# Altium schematic sheet Micro_Conection.SchDoc (part 1 of 3)
size A
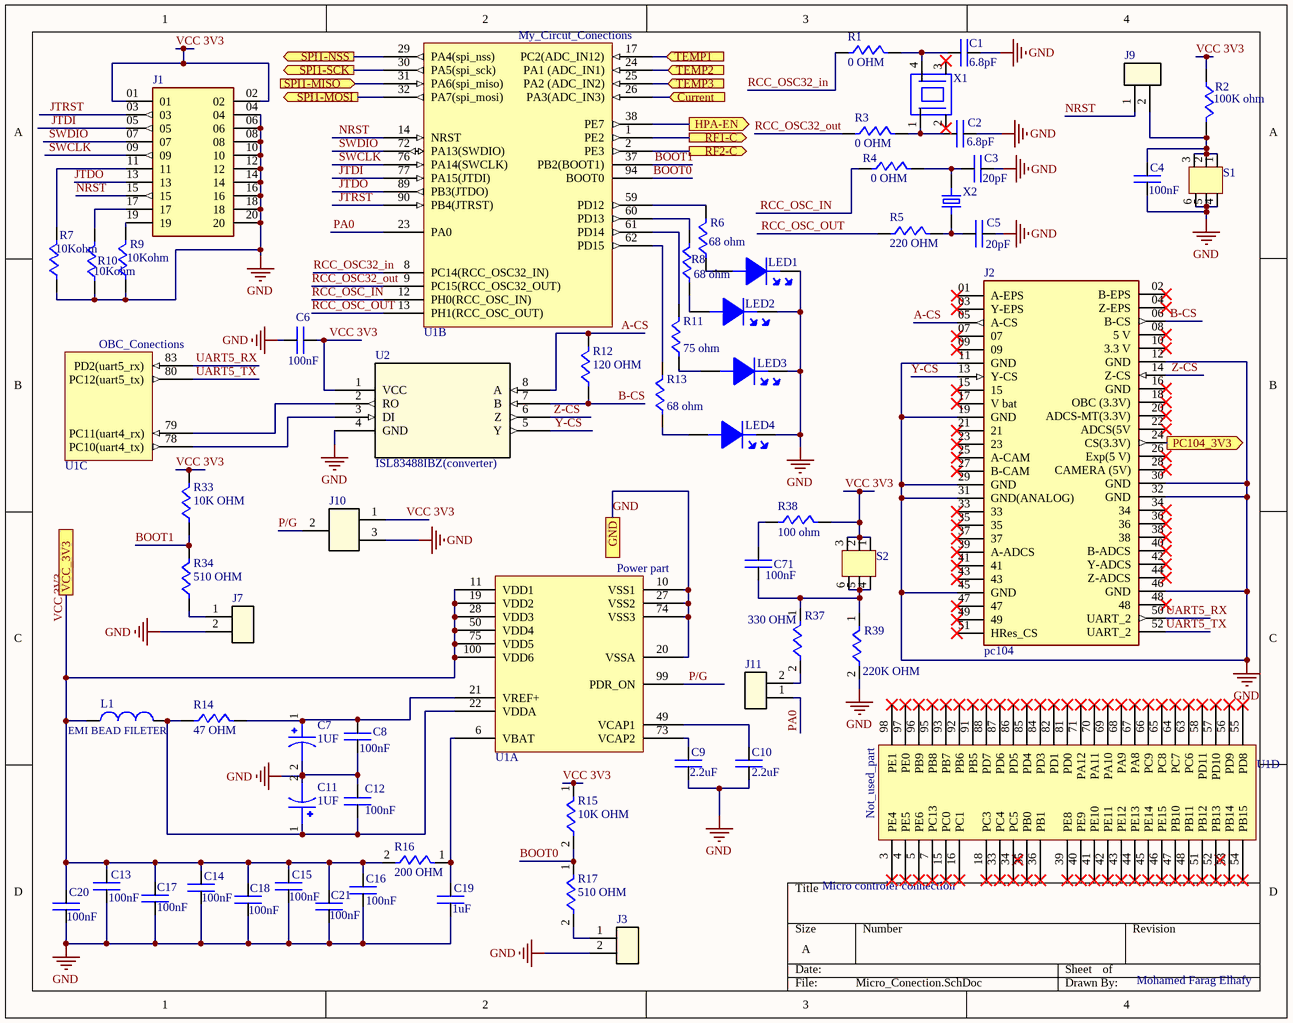
[diagram p0: Micro_Conection.SchDoc]

## Parts
C1  Capacitance: 6.8pF  [0805 C]  (hidden comment: CAP CER 6.8PF 100V NPO 0805)
C2  Capacitance: 6.8pF  [0805 C]  (hidden comment: CAP CER 6.8PF 100V NPO 0805)
C3  Capacitance: 20pF  [0805 C]  (hidden comment: CAP CER 20PF 25V NP0 0603)
C4  Capacitance: 100nF  [0805 C]  (hidden comment: CAP CER 0.1UF 10V 0805)
C5  Capacitance: 20pF  [0805 C]  (hidden comment: CAP CER 20PF 25V NP0 0603)
C6  Capacitance: 100nF  [0805 C]  (hidden comment: CAP CER 0.1UF 10V 0805)
C7  1UF  [1206 C]
C8  Capacitance: 100nF  [0805 C]  (hidden comment: CAP CER 0.1UF 10V 0805)
C9  Capacitance: 2.2uF  [0805 C]  (hidden comment: CAP CER 2.2UF 25V X7R 0805)
C10  Capacitance: 2.2uF  [0805 C]  (hidden comment: CAP CER 2.2UF 25V X7R 0805)
C11  1UF  [1206 C]
C12  Capacitance: 100nF  [0805 C]  (hidden comment: CAP CER 0.1UF 10V 0805)
C13  Capacitance: 100nF  [0805 C]  (hidden comment: CAP CER 0.1UF 10V 0805)
C14  Capacitance: 100nF  [0805 C]  (hidden comment: CAP CER 0.1UF 10V 0805)
C15  Capacitance: 100nF  [0805 C]  (hidden comment: CAP CER 0.1UF 10V 0805)
C16  Capacitance: 100nF  [0805 C]  (hidden comment: CAP CER 0.1UF 10V 0805)
C17  Capacitance: 100nF  [0805 C]  (hidden comment: CAP CER 0.1UF 10V 0805)
C18  Capacitance: 100nF  [0805 C]  (hidden comment: CAP CER 0.1UF 10V 0805)
C19  Capacitance: 1uF  [0805 C]  (hidden comment: CAP CER 1UF 16V X7R 0805)
C20  Capacitance: 100nF  [0805 C]  (hidden comment: CAP CER 0.1UF 10V 0805)
C21  Capacitance: 100nF  [0805 C]  (hidden comment: CAP CER 0.1UF 10V 0805)
C71  Capacitance: 100nF  [0805 C]  (hidden comment: CAP CER 0.1UF 10V 0805)
J1  CONN HEADER VERT 20POS 2.54MM  [JTAG]  (value not drawn)
J2  pc104  [pc104]
J3  CONN HEADER VERT 2POS 2.54MM  [jumber 2]  (value not drawn)
J7  CONN HEADER VERT 2POS 2.54MM  [jumber 2]  (value not drawn)
J9  CONN HEADER VERT 2POS 2.54MM  [jumber 2]  (value not drawn)
J10  CONN HEADER VERT 3POS 2.54MM  [jumber]  (value not drawn)
J11  CONN HEADER VERT 2POS 2.54MM  [jumber 2]  (value not drawn)
L1  EMI BEAD FILETER  [0805 C]
LED1  LED GREEN CLEAR CHIP SMD R/A  [LED]  (value not drawn)
LED2  LED ORANGE CLEAR SMD  [LED]  (value not drawn)
LED3  LED RED CLEAR SMD  [LED]  (value not drawn)
LED4  LED YELLOW CLEAR SMD  [LED]  (value not drawn)
R1  0 OHM  [0805 R]
R2  100K ohm  [0805 R]
R3  0 OHM  [0805 R]
R4  0 OHM  [0805 R]
R5  220 OHM  [0805 R]
R6  Resistance: 68 ohm  [0805 R]  (hidden comment: RES 68 OHM 5% 1/4W 0805)
R7  10Kohm  [0805 R]
R8  Resistance: 68 ohm  [0805 R]  (hidden comment: RES 68 OHM 5% 1/4W 0805)
R9  10Kohm  [0805 R]
R10  10Kohm  [0805 R]
R11  Resistance: 75 ohm  [0805 R]  (hidden comment: RES 75 OHM 1% 1/4W 0805)
R12  120 OHM  [0805 R]
R13  Resistance: 68 ohm  [0805 R]  (hidden comment: RES 68 OHM 5% 1/4W 0805)
R14  47 OHM  [0805 R]
R15  10K OHM  [0805 R]
R16  200 OHM  [0805 R]
R17  510 OHM  [0805 R]
R33  10K OHM  [0805 R]
R34  510 OHM  [0805 R]
R37  330 OHM  [0805 R]
R38  Resistance: 100 ohm  [0805 R]  (hidden comment: RES SMD 100 OHM 5% 1/2W 0805)
R39  220K OHM  [0805 R]
S1  Pushbutton Switches 2 Poles Vertical  [push button]  (value not drawn)
S2  Pushbutton Switches 2 Poles Vertical  [push button]  (value not drawn)
U1  STM32F407VGT6_1  [STM32F407VGT6 P]  (value not drawn)  (parts A,B,C,D of 4)
U2  ISL83488IBZ(converter)  [ISL83488IBZ]
X1  MC-146 32.7680KA-E3: ROHS  [CRYSTAL 32K]  (value not drawn)
X2  CRYSTAL 8.0000MHZ 32PF SMD  [XTAL_ECS-80-32-5PX-TR]  (value not drawn)

## Ports
Current (in), GND, HPA-EN (out), PC104_3V3 (out), RF1-C (out), RF2-C (out), SPI1-MISO (in), SPI1-MOSI (out), SPI1-NSS (out), SPI1-SCK (out), TEMP1 (in), TEMP2 (in), TEMP3 (in), VCC_3V3

## Nets
GND: C1.1 C2.1 C3.1 C4.2 C5.1 C6.1 C7.2 C8.2 C9.2 C10.2 C11.2 C12.1 C13.2 C14.2 C15.2 C16.2 C17.2 C18.2 C19.2 C20.2 C21.2 J1.04 J1.06 J1.08 J1.10 J1.12 J1.14 J1.16 J1.18 J1.20 J2.11(GND) J2.12(GND) J2.19(GND) J2.29(GND) J2.30(GND) J2.31(GND(ANALOG)) J2.32(GND) J2.45(GND) J2.46(GND) J3.2 J7.2 J10.3 LED1.2 LED2.2 LED3.2 LED4.2 R7.2 R9.2 R10.2 R39.2 S1.4 S1.5 S1.6 U1.10(VSS1) U1.20(VSSA) U1.27(VSS2) U1.74(VSS3) U2.4(GND) ; port GND
A-CS: J2.05(A-CS) R12.1 U2.8(A)
B-CS: J2.06(B-CS) R12.2 U2.7(B)
BOOT0: R15.2 R17.1 U1.94(BOOT0)
BOOT1: R33.2 R34.1 U1.37(PB2(BOOT1))
Current: U1.26(PA3(ADC_IN3)) ; port Current
HPA-EN: U1.38(PE7) ; port HPA-EN
JTDI: J1.05 U1.77(PA15(JTDI))
JTDO: J1.13 U1.89(PB3(JTDO))
JTRST: J1.03 U1.90(PB4(JTRST))
NRST: J1.15 J9.1 U1.14(NRST)
P/G: J10.2 U1.99(PDR_ON)
PA0: J11.1 U1.23(PA0)
PC104_3V3: J2.24(CS(3.3V)) ; port PC104_3V3
RCC_OSC32_in: R1.2 U1.8(PC14(RCC_OSC32_IN))
RCC_OSC32_out: R3.2 U1.9(PC15(RCC_OSC32_OUT))
RCC_OSC_IN: R4.2 U1.12(PH0(RCC_OSC_IN))
RCC_OSC_OUT: R5.2 U1.13(PH1(RCC_OSC_OUT))
RF1-C: U1.1(PE2) ; port RF1-C
RF2-C: U1.2(PE3) ; port RF2-C
SPI1-MISO: U1.31(PA6(spi_miso)) ; port SPI1-MISO
SPI1-MOSI: U1.32(PA7(spi_mosi)) ; port SPI1-MOSI
SPI1-NSS: U1.29(PA4(spi_nss)) ; port SPI1-NSS
SPI1-SCK: U1.30(PA5(spi_sck)) ; port SPI1-SCK
SWCLK: J1.09 U1.76(PA14(SWCLK))
SWDIO: J1.07 U1.72(PA13(SWDIO))
TEMP1: U1.17(PC2(ADC_IN12)) ; port TEMP1
TEMP2: U1.24(PA1_(ADC_IN1)) ; port TEMP2
TEMP3: U1.25(PA2_(ADC_IN2)) ; port TEMP3
UART5_RX: J2.50(UART_2) U1.83(PD2(uart5_rx))
UART5_TX: J2.52(UART_2) U1.80(PC12(uart5_tx))
VCC 3V3: C6.2 C13.1 C14.1 C15.1 C16.1 C17.1 C18.1 C20.1 C21.1 J1.01 J1.02 J10.1 L1.2 R2.2 R15.1 R16.2 R33.1 R38.1 S2.1 S2.2 S2.3 U1.11(VDD1) U1.19(VDD2) U1.28(VDD3) U1.50(VDD4) U1.75(VDD5) U1.100(VDD6) U2.1(VCC) ; port VCC_3V3
Y-CS: J2.13(Y-CS) U2.5(Y)
Z-CS: J2.14(Z-CS) U2.6(Z)
NetC1_2: C1.2 R1.1 X1.4
NetC2_2: C2.2 R3.1 X1.1
NetC3_2: C3.2 R4.1 X2.2
NetC4_1: C4.1 J9.2 R2.1 S1.1 S1.2 S1.3
NetC5_2: C5.2 R5.1 X2.1
NetC7_1: C7.1 C8.1 R14.1 U1.21(VREF+)
NetC9_1: C9.1 U1.73(VCAP2)
NetC10_1: C10.1 U1.49(VCAP1)
NetC11_1: C11.1 C12.2 L1.1 R14.2 U1.22(VDDA)
NetC19_1: C19.1 R16.1 U1.6(VBAT)
NetC71_1: C71.1 R38.2
NetC71_2: C71.2 R37.1 R39.1 S2.4 S2.5 S2.6
NetJ1_11: J1.11 R7.1
NetJ1_17: J1.17 R10.1
NetJ1_19: J1.19 R9.1
NetJ3_1: J3.1 R17.2
NetJ7_1: J7.1 R34.2
NetJ11_2: J11.2 R37.2
NetLED1_1: LED1.1 R6.2
NetLED2_1: LED2.1 R8.2
NetLED3_1: LED3.1 R11.2
NetLED4_1: LED4.1 R13.2
NetR6_1: R6.1 U1.59(PD12)
NetR8_1: R8.1 U1.60(PD13)
NetR11_1: R11.1 U1.61(PD14)
NetR13_1: R13.1 U1.62(PD15)
NetU1_78: U1.78(PC10(uart4_tx)) U2.3(DI)
NetU1_79: U1.79(PC11(uart4_rx)) U2.2(RO)

Not connected (* = marked no-connect by the designer): J2 01(A-EPS)* 02(B-EPS)* 03(Y-EPS)* 04(Z-EPS)* 07* 08(5_V)* 09* 10(3.3_V)* 15* 16(GND)* 17(V_bat)* 18(OBC_(3.3V))* 20(ADCS-MT(3.3V))* 21* 22(ADCS(5V)* 23* 25(A-CAM)* 26(Exp(5_V))* 27(B-CAM)* 28(CAMERA_(5V))* 33* 34* 35* 36* 37* 38* 39(A-ADCS)* 40(B-ADCS)* 41* 42(Y-ADCS)* 43* 44(Z-ADCS)* 47* 48* 49* 51(HRes_CS)*; U1 3(PE4)* 4(PE5)* 5(PE6)* 7(PC13)* 15(PC0)* 16(PC1)* 18(PC3)* 33(PC4)* 34(PC5)* 35(PB0)* 36(PB1)* 39(PE8)* 40(PE9)* 41(PE10)* 42(PE11)* 43(PE12)* 44(PE13)* 45(PE14)* 46(PE15)* 47(PB10)* 48(PB11)* 51(PB12)* 52(PB13)* 53(PB14)* 54(PB15)* 55(PD8)* 56(PD9)* 57(PD10)* 58(PD11)* 63(PC6)* 64(PC7)* 65(PC8)* 66(PC9)* 67(PA8)* 68(PA9)* 69(PA10)* 70(PA11)* 71(PA12)* 81(PD0)* 82(PD1)* 84(PD3)* 85(PD4)* 86(PD5)* 87(PD6)* 88(PD7)* 91(PB5)* 92(PB6)* 93(PB7)* 95(PB8)* 96(PB9)* 97(PE0)* 98(PE1)*; X1 2(GND)* 3(GND)*

## Notes on the sheet
- (near U1) Micro controler connection
- Mohamed Farag Elhafy
- (in symbol STM32F407VGT6_1, part A) Power part
- (in symbol STM32F407VGT6_1, part B) My_Circut_Conections
- (in symbol STM32F407VGT6_1, part C) OBC_Conections
- (in symbol STM32F407VGT6_1, part D) Not_used_part